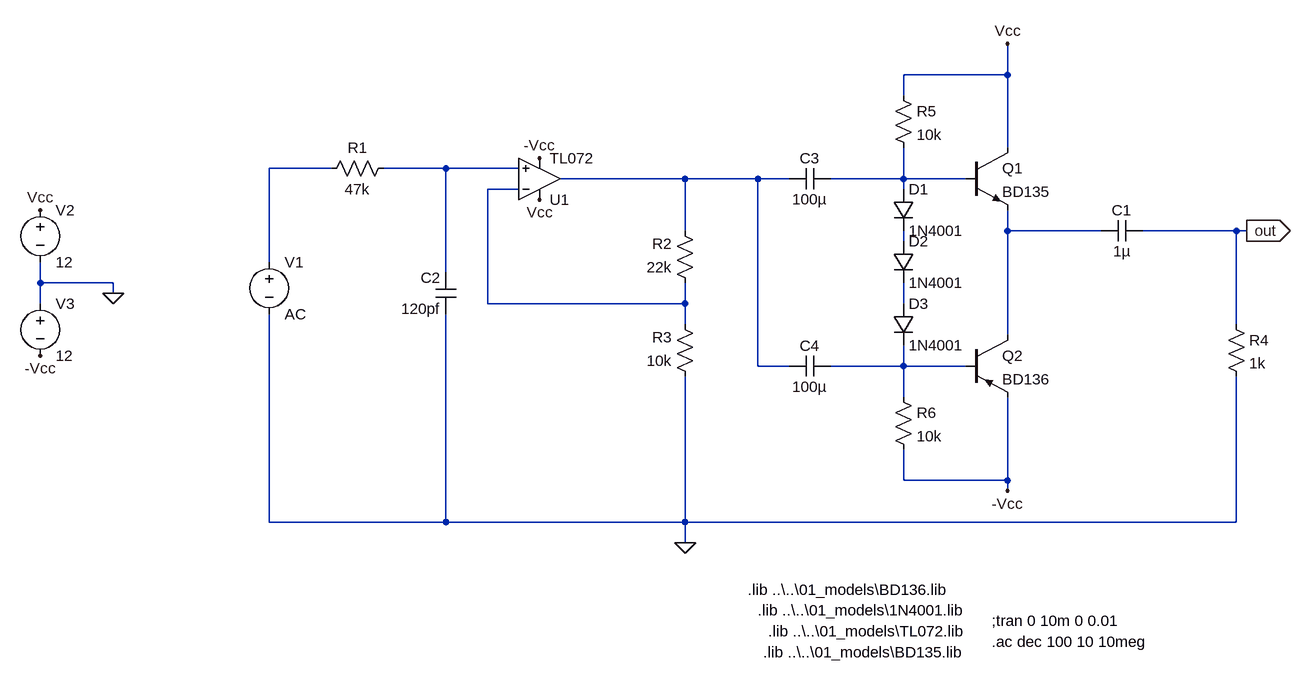
[diagram p0: schematic classab.asc]
classab.asc, the LTspice schematic file:
Version 4
SHEET 1 1368 856
WIRE 896 -48 896 -96
WIRE 896 -48 736 -48
WIRE 736 -16 736 -48
WIRE 896 64 896 -48
WIRE -144 96 -240 96
WIRE 32 96 -64 96
WIRE 144 96 32 96
WIRE 400 112 208 112
WIRE 512 112 400 112
WIRE 560 112 512 112
WIRE 736 112 736 64
WIRE 736 112 624 112
WIRE 832 112 736 112
WIRE 144 128 96 128
WIRE 736 128 736 112
WIRE 400 192 400 112
WIRE 896 192 896 160
WIRE 1040 192 896 192
WIRE 1248 192 1104 192
WIRE 1264 192 1248 192
WIRE 736 208 736 192
WIRE -240 240 -240 96
WIRE 32 256 32 96
WIRE -592 272 -592 240
WIRE -480 272 -592 272
WIRE -480 288 -480 272
WIRE -592 304 -592 272
WIRE 96 304 96 128
WIRE 400 304 400 272
WIRE 400 304 96 304
WIRE 736 304 736 272
WIRE 400 336 400 304
WIRE 1248 336 1248 192
WIRE 896 352 896 192
WIRE 512 400 512 112
WIRE 560 400 512 400
WIRE 736 400 736 368
WIRE 736 400 624 400
WIRE 832 400 736 400
WIRE 736 448 736 400
WIRE 736 576 736 528
WIRE 896 576 896 448
WIRE 896 576 736 576
WIRE 896 592 896 576
WIRE -240 640 -240 320
WIRE 32 640 32 320
WIRE 32 640 -240 640
WIRE 400 640 400 416
WIRE 400 640 32 640
WIRE 1248 640 1248 416
WIRE 1248 640 400 640
WIRE 400 672 400 640
FLAG 400 672 0
FLAG -480 288 0
FLAG -592 160 Vcc
FLAG -592 384 -Vcc
FLAG 176 80 -Vcc
FLAG 896 -96 Vcc
FLAG 176 144 Vcc
FLAG 896 592 -Vcc
FLAG 1264 192 out
IOPIN 1264 192 Out
SYMBOL Opamps\\opamp2 176 176 M180
SYMATTR InstName U1
SYMATTR Value TL072
SYMBOL res -48 80 R90
WINDOW 0 0 56 VBottom 2
WINDOW 3 32 56 VTop 2
SYMATTR InstName R1
SYMATTR Value 47k
SYMBOL res 416 288 R180
WINDOW 0 36 76 Left 2
WINDOW 3 36 40 Left 2
SYMATTR InstName R2
SYMATTR Value 22k
SYMBOL res 416 432 R180
WINDOW 0 36 76 Left 2
WINDOW 3 36 40 Left 2
SYMATTR InstName R3
SYMATTR Value 10k
SYMBOL npn 832 64 R0
SYMATTR InstName Q1
SYMATTR Value BD135
SYMBOL pnp 832 352 R0
SYMATTR InstName Q2
SYMATTR Value BD136
SYMBOL cap 1104 176 R90
WINDOW 0 0 32 VBottom 2
WINDOW 3 32 32 VTop 2
SYMATTR InstName C1
SYMATTR Value 1µ
SYMBOL cap 48 320 R180
WINDOW 0 24 56 Left 2
WINDOW 3 24 8 Left 2
SYMATTR InstName C2
SYMATTR Value 120pf
SYMBOL voltage -240 224 R0
WINDOW 123 0 0 Left 2
WINDOW 39 0 0 Left 2
SYMATTR InstName V1
SYMATTR Value AC
SYMBOL res 1232 320 R0
SYMATTR InstName R4
SYMATTR Value 1k
SYMBOL voltage -592 144 R0
WINDOW 123 0 0 Left 2
WINDOW 39 0 0 Left 2
SYMATTR InstName V2
SYMATTR Value 12
SYMBOL voltage -592 288 R0
WINDOW 123 0 0 Left 2
WINDOW 39 0 0 Left 2
SYMATTR InstName V3
SYMATTR Value 12
SYMBOL res 720 -32 R0
SYMATTR InstName R5
SYMATTR Value 10k
SYMBOL res 720 432 R0
SYMATTR InstName R6
SYMATTR Value 10k
SYMBOL cap 624 96 R90
WINDOW 0 0 32 VBottom 2
WINDOW 3 32 32 VTop 2
SYMATTR InstName C3
SYMATTR Value 100µ
SYMBOL cap 624 384 R90
WINDOW 0 0 32 VBottom 2
WINDOW 3 32 32 VTop 2
SYMATTR InstName C4
SYMATTR Value 100µ
SYMBOL diode 720 128 R0
SYMATTR InstName D1
SYMATTR Value 1N4001
SYMBOL diode 720 208 R0
SYMATTR InstName D2
SYMATTR Value 1N4001
SYMBOL diode 720 304 R0
SYMATTR InstName D3
SYMATTR Value 1N4001
TEXT 528 808 Left 2 !.lib ..\\..\\01_models\\TL072.lib
TEXT 520 840 Left 2 !.lib ..\\..\\01_models\\BD135.lib
TEXT 496 744 Left 2 !.lib ..\\..\\01_models\\BD136.lib
TEXT 872 792 Left 2 !;tran 0 10m 0 0.01
TEXT 872 824 Left 2 !.ac dec 100 10 10meg
TEXT 512 776 Left 2 !.lib ..\\..\\01_models\\1N4001.lib

The netlist it stands for:
* classab.asc
XU1 N002 N005 Vcc -Vcc N003 TL072  ; pins In+ In- V+ V- OUT
R1 N002 N001 47k
R2 N005 N003 22k
R3 0 N005 10k
Q1 Vcc N004 N006 0 BD135
Q2 N006 N009 -Vcc 0 BD136
C1 out N006 1µ
C2 0 N002 120pf
V1 N001 0 AC
R4 out 0 1k
V2 Vcc 0 12
V3 0 -Vcc 12
R5 Vcc N004 10k
R6 N009 -Vcc 10k
C3 N004 N003 100µ
C4 N009 N003 100µ
D1 N004 N007 1N4001
D2 N007 N008 1N4001
D3 N008 N009 1N4001
.model D D
.lib standard.dio
.model NPN NPN
.model PNP PNP
.lib standard.bjt
.lib ..\..\01_models\TL072.lib
.lib ..\..\01_models\BD135.lib
.lib ..\..\01_models\BD136.lib
;tran 0 10m 0 0.01
.ac dec 100 10 10meg
.lib ..\..\01_models\1N4001.lib
.backanno
.end